# Altium project Origin_pi.PrjPcb
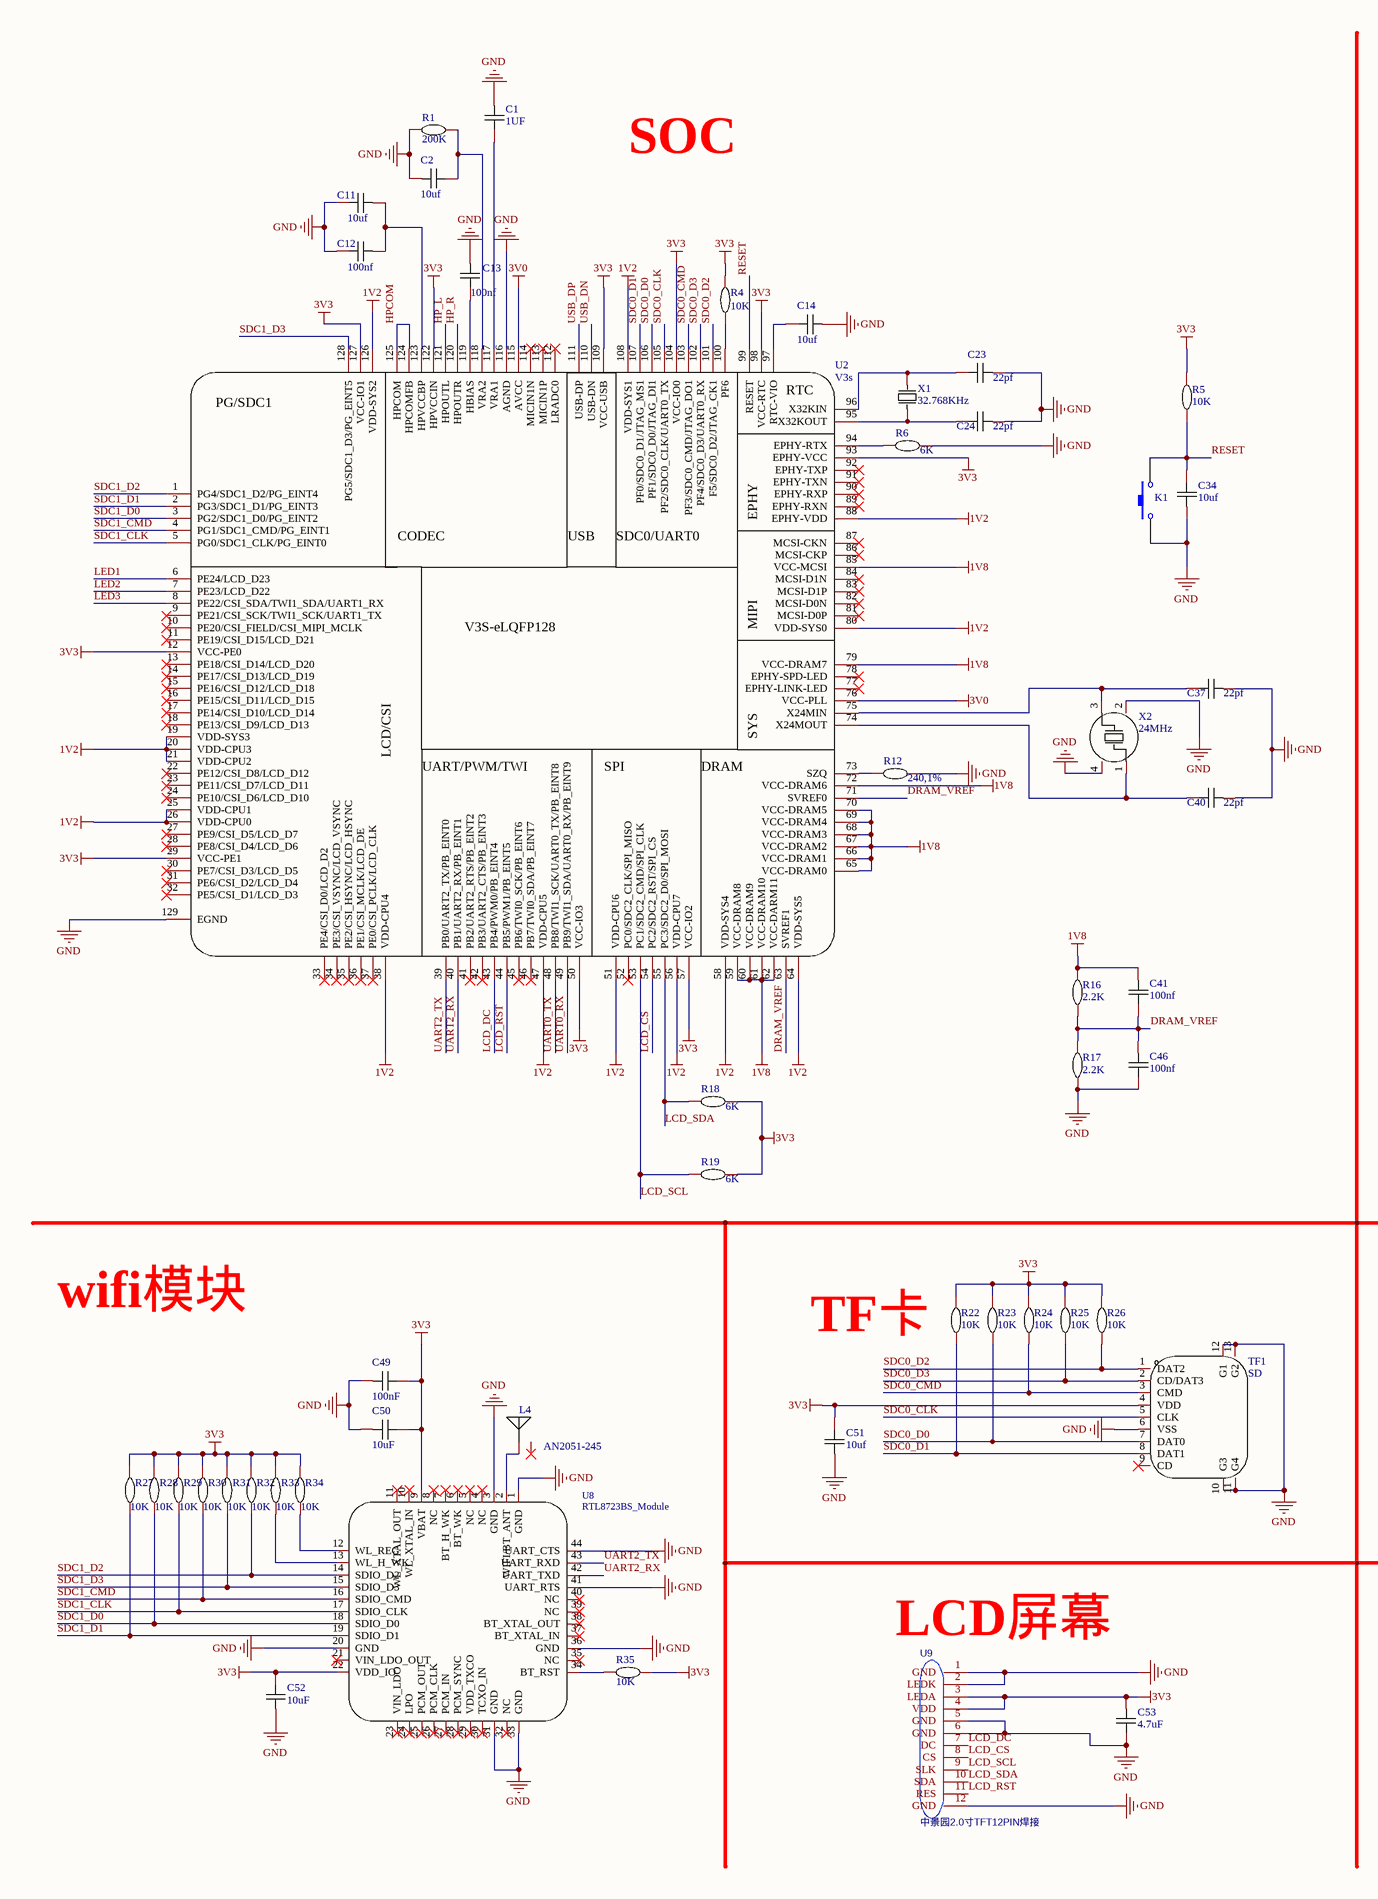
[diagram p0: Origin_pi.SchDoc, left]
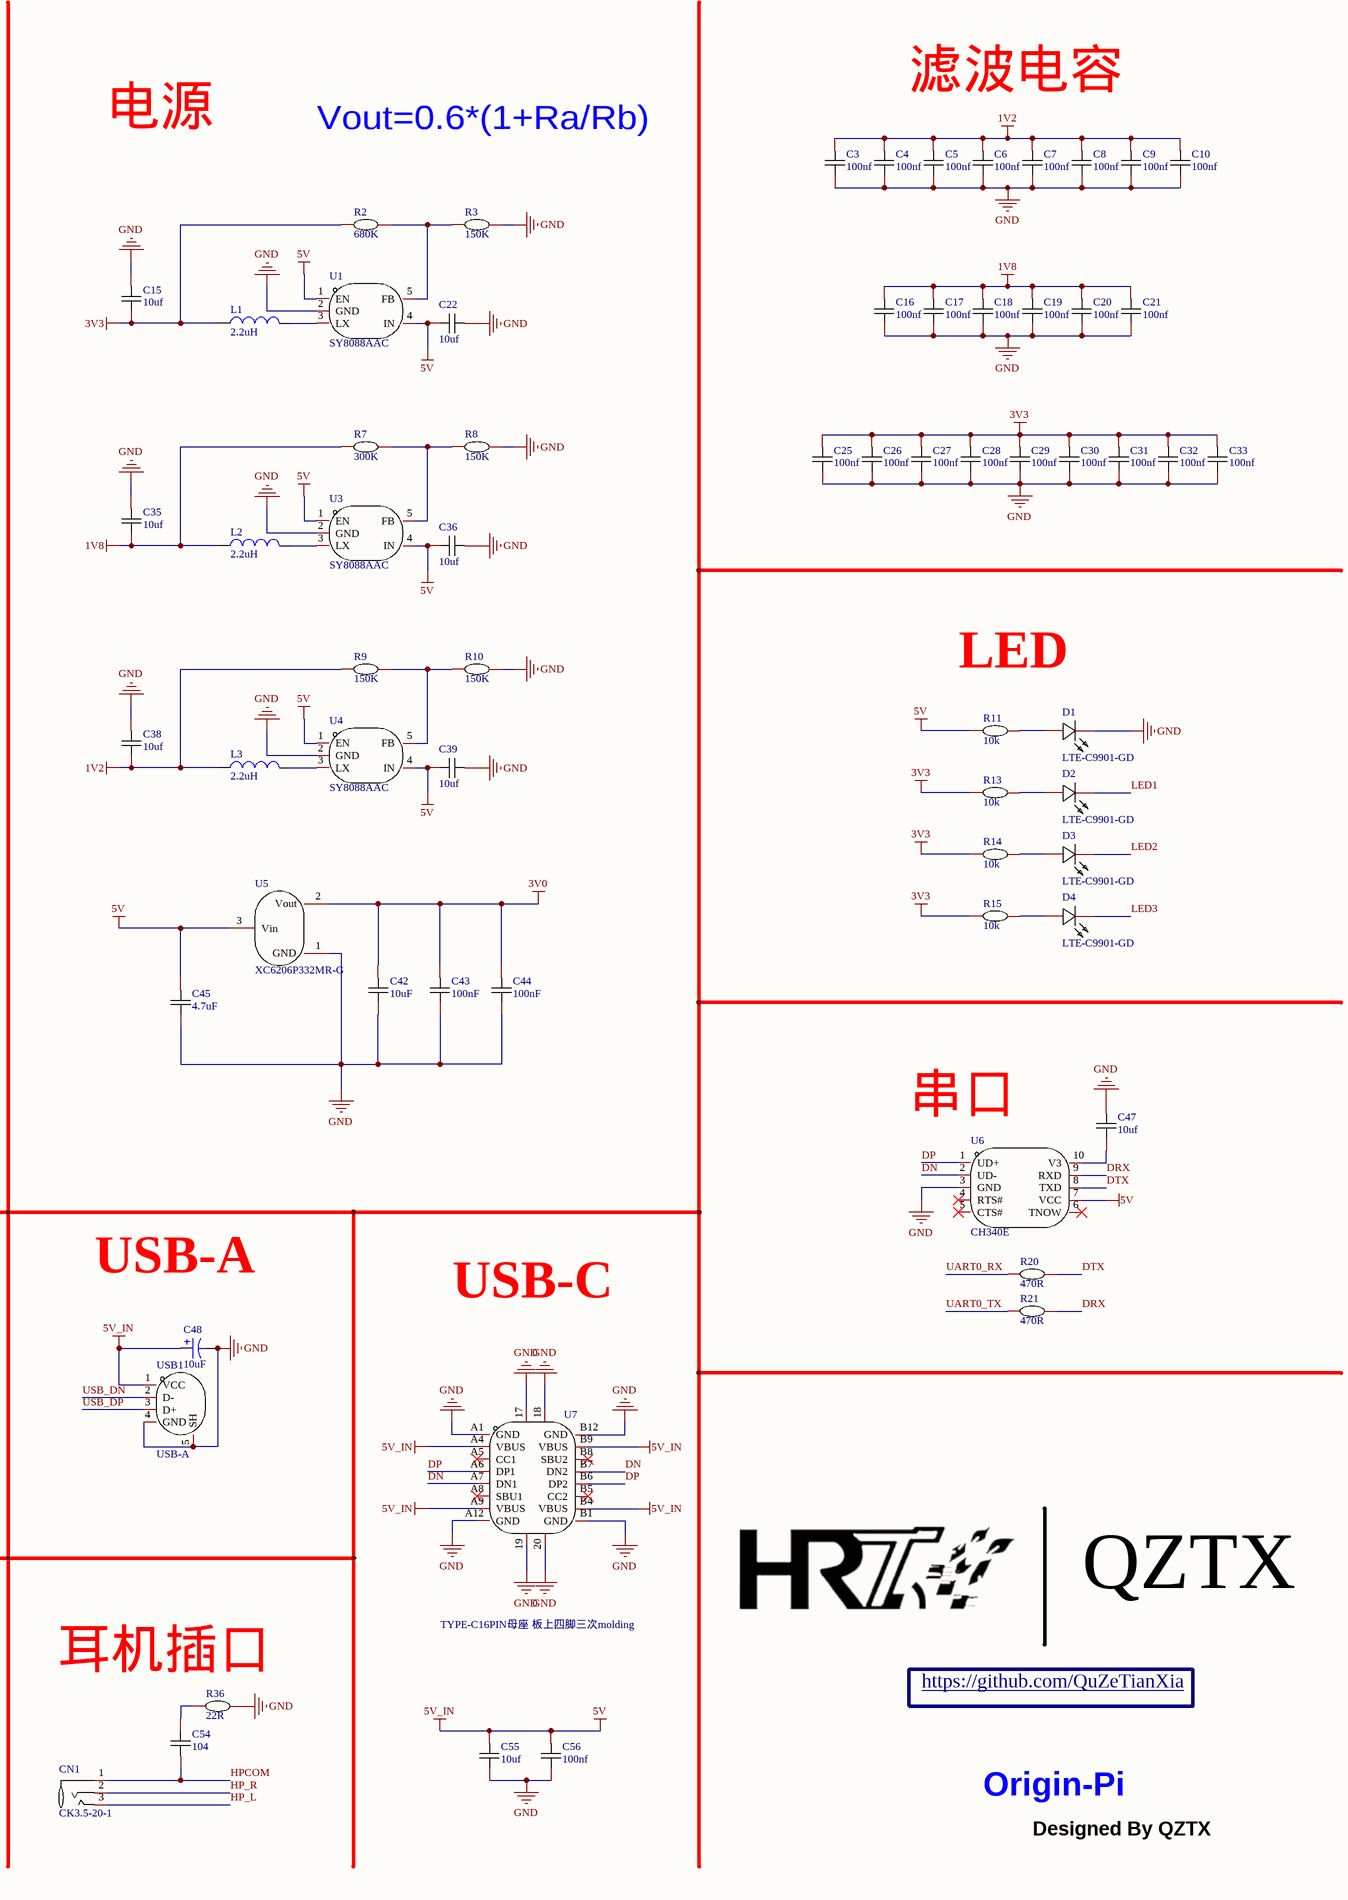
[diagram p1: Origin_pi.SchDoc, right]
1 sheet, 115 parts. Net scope: global (net labels, ports and power ports of the same name join across sheets).
Board file: Origin_pi.PcbDoc

## Sheet Origin_pi.SchDoc
size A2; SheetNumber: 1; SheetTotal: 1

### Parts
C1  Name: 1UF  [PCBComponent_1]  (hidden comment: 0603DS475K160NT)
C2  Name: 10uf  [PCBComponent_1]  (hidden comment: 0603DS475K160NT)
C3  Name: 100nf  [PCBComponent_1]  (hidden comment: 0603DS475K160NT)
C4  Name: 100nf  [PCBComponent_1]  (hidden comment: 0603DS475K160NT)
C5  Name: 100nf  [PCBComponent_1]  (hidden comment: 0603DS475K160NT)
C6  Name: 100nf  [PCBComponent_1]  (hidden comment: 0603DS475K160NT)
C7  Name: 100nf  [PCBComponent_1]  (hidden comment: 0603DS475K160NT)
C8  Name: 100nf  [PCBComponent_1]  (hidden comment: 0603DS475K160NT)
C9  Name: 100nf  [PCBComponent_1]  (hidden comment: 0603DS475K160NT)
C10  Name: 100nf  [PCBComponent_1]  (hidden comment: 0603DS475K160NT)
C11  Name: 10uf  [PCBComponent_1]  (hidden comment: 0603DS475K160NT)
C12  Name: 100nf  [PCBComponent_1]  (hidden comment: 0603DS475K160NT)
C13  Name: 100nf  [PCBComponent_1]  (hidden comment: 0603DS475K160NT)
C14  Name: 10uf  [PCBComponent_1]  (hidden comment: 0603DS475K160NT)
C15  Name: 10uf  [PCBComponent_1]  (hidden comment: 0603DS475K160NT)
C16  Name: 100nf  [PCBComponent_1]  (hidden comment: 0603DS475K160NT)
C17  Name: 100nf  [PCBComponent_1]  (hidden comment: 0603DS475K160NT)
C18  Name: 100nf  [PCBComponent_1]  (hidden comment: 0603DS475K160NT)
C19  Name: 100nf  [PCBComponent_1]  (hidden comment: 0603DS475K160NT)
C20  Name: 100nf  [PCBComponent_1]  (hidden comment: 0603DS475K160NT)
C21  Name: 100nf  [PCBComponent_1]  (hidden comment: 0603DS475K160NT)
C22  Name: 10uf  [PCBComponent_1]  (hidden comment: 0603DS475K160NT)
C23  Name: 22pf  [PCBComponent_1]  (hidden comment: 0603DS475K160NT)
C24  Name: 22pf  [PCBComponent_1]  (hidden comment: 0603DS475K160NT)
C25  Name: 100nf  [PCBComponent_1]  (hidden comment: 0603DS475K160NT)
C26  Name: 100nf  [PCBComponent_1]  (hidden comment: 0603DS475K160NT)
C27  Name: 100nf  [PCBComponent_1]  (hidden comment: 0603DS475K160NT)
C28  Name: 100nf  [PCBComponent_1]  (hidden comment: 0603DS475K160NT)
C29  Name: 100nf  [PCBComponent_1]  (hidden comment: 0603DS475K160NT)
C30  Name: 100nf  [PCBComponent_1]  (hidden comment: 0603DS475K160NT)
C31  Name: 100nf  [PCBComponent_1]  (hidden comment: 0603DS475K160NT)
C32  Name: 100nf  [PCBComponent_1]  (hidden comment: 0603DS475K160NT)
C33  Name: 100nf  [PCBComponent_1]  (hidden comment: 0603DS475K160NT)
C34  Name: 10uf  [PCBComponent_1]  (hidden comment: 0603DS475K160NT)
C35  Name: 10uf  [PCBComponent_1]  (hidden comment: 0603DS475K160NT)
C36  Name: 10uf  [PCBComponent_1]  (hidden comment: 0603DS475K160NT)
C37  Name: 22pf  [PCBComponent_1]  (hidden comment: 0603DS475K160NT)
C38  Name: 10uf  [PCBComponent_1]  (hidden comment: 0603DS475K160NT)
C39  Name: 10uf  [PCBComponent_1]  (hidden comment: 0603DS475K160NT)
C40  Name: 22pf  [PCBComponent_1]  (hidden comment: 0603DS475K160NT)
C41  Name: 100nf  [PCBComponent_1]  (hidden comment: 0603DS475K160NT)
C42  Name: 10uF  [PCBComponent_1]  (hidden comment: 0603DS475K160NT)
C43  Name: 100nF  [PCBComponent_1]  (hidden comment: 0603DS475K160NT)
C44  Name: 100nF  [PCBComponent_1]  (hidden comment: 0603DS475K160NT)
C45  Name: 4.7uF  [PCBComponent_1]  (hidden comment: 0603DS475K160NT)
C46  Name: 100nf  [PCBComponent_1]  (hidden comment: 0603DS475K160NT)
C47  Name: 10uf  [PCBComponent_1]  (hidden comment: 0603DS475K160NT)
C48  10uF  [CP 3528B]
C49  Name: 100nF  [PCBComponent_1]  (hidden comment: 0603DS475K160NT)
C50  Name: 10uF  [PCBComponent_1]  (hidden comment: 0603DS475K160NT)
C51  Name: 10uf  [PCBComponent_1]  (hidden comment: 0603DS475K160NT)
C52  Name: 10uF  [PCBComponent_1]  (hidden comment: 0603DS475K160NT)
C53  Name: 4.7uF  [PCBComponent_1]  (hidden comment: 0603DS475K160NT)
C54  Name: 104  [PCBComponent_1]  (hidden comment: 0603DS475K160NT)
C55  Name: 10uf  [PCBComponent_1]  (hidden comment: 0603DS475K160NT)
C56  Name: 100nf  [PCBComponent_1]  (hidden comment: 0603DS475K160NT)
CN1  CK3.5-20-1  [AUDIO-SMD_CK3.5-20-1]
D1  LTE-C9901-GD  [LED0603-RD]
D2  LTE-C9901-GD  [LED0603-RD]
D3  LTE-C9901-GD  [LED0603-RD]
D4  LTE-C9901-GD  [LED0603-RD]
K1  Key  [KEY 3.6*2.5 SMD]  (value not drawn)
L1  2.2uH  [L 0805]
L2  2.2uH  [L 0805]
L3  2.2uH  [L 0805]
L4  AN2051-245  [ANT2051]
R1  Name: 200K  [PCBComponent_1]  (hidden comment: 贴片电阻_0603_100K_±1%_1/10W)
R2  Name: 680K  [PCBComponent_1]  (hidden comment: 贴片电阻_0603_100K_±1%_1/10W)
R3  Name: 150K  [PCBComponent_1]  (hidden comment: 贴片电阻_0603_100K_±1%_1/10W)
R4  Name: 10K  [PCBComponent_1]  (hidden comment: 贴片电阻_0603_100K_±1%_1/10W)
R5  Name: 10K  [PCBComponent_1]  (hidden comment: 贴片电阻_0603_100K_±1%_1/10W)
R6  Name: 6K  [PCBComponent_1]  (hidden comment: 贴片电阻_0603_100K_±1%_1/10W)
R7  Name: 300K  [PCBComponent_1]  (hidden comment: 贴片电阻_0603_100K_±1%_1/10W)
R8  Name: 150K  [PCBComponent_1]  (hidden comment: 贴片电阻_0603_100K_±1%_1/10W)
R9  Name: 150K  [PCBComponent_1]  (hidden comment: 贴片电阻_0603_100K_±1%_1/10W)
R10  Name: 150K  [PCBComponent_1]  (hidden comment: 贴片电阻_0603_100K_±1%_1/10W)
R11  Name: 10k  [PCBComponent_1]  (hidden comment: 贴片电阻_0603_100K_±1%_1/10W)
R12  Name: 240,1%  [PCBComponent_1]  (hidden comment: 贴片电阻_0603_100K_±1%_1/10W)
R13  Name: 10k  [PCBComponent_1]  (hidden comment: 贴片电阻_0603_100K_±1%_1/10W)
R14  Name: 10k  [PCBComponent_1]  (hidden comment: 贴片电阻_0603_100K_±1%_1/10W)
R15  Name: 10k  [PCBComponent_1]  (hidden comment: 贴片电阻_0603_100K_±1%_1/10W)
R16  Name: 2.2K  [PCBComponent_1]  (hidden comment: 贴片电阻_0603_100K_±1%_1/10W)
R17  Name: 2.2K  [PCBComponent_1]  (hidden comment: 贴片电阻_0603_100K_±1%_1/10W)
R18  Name: 6K  [PCBComponent_1]  (hidden comment: 贴片电阻_0603_100K_±1%_1/10W)
R19  Name: 6K  [PCBComponent_1]  (hidden comment: 贴片电阻_0603_100K_±1%_1/10W)
R20  Name: 470R  [PCBComponent_1]  (hidden comment: 贴片电阻_0603_100K_±1%_1/10W)
R21  Name: 470R  [PCBComponent_1]  (hidden comment: 贴片电阻_0603_100K_±1%_1/10W)
R22  Name: 10K  [PCBComponent_1]  (hidden comment: 贴片电阻_0603_100K_±1%_1/10W)
R23  Name: 10K  [PCBComponent_1]  (hidden comment: 贴片电阻_0603_100K_±1%_1/10W)
R24  Name: 10K  [PCBComponent_1]  (hidden comment: 贴片电阻_0603_100K_±1%_1/10W)
R25  Name: 10K  [PCBComponent_1]  (hidden comment: 贴片电阻_0603_100K_±1%_1/10W)
R26  Name: 10K  [PCBComponent_1]  (hidden comment: 贴片电阻_0603_100K_±1%_1/10W)
R27  Name: 10K  [PCBComponent_1]  (hidden comment: 贴片电阻_0603_100K_±1%_1/10W)
R28  Name: 10K  [PCBComponent_1]  (hidden comment: 贴片电阻_0603_100K_±1%_1/10W)
R29  Name: 10K  [PCBComponent_1]  (hidden comment: 贴片电阻_0603_100K_±1%_1/10W)
R30  Name: 10K  [PCBComponent_1]  (hidden comment: 贴片电阻_0603_100K_±1%_1/10W)
R31  Name: 10K  [PCBComponent_1]  (hidden comment: 贴片电阻_0603_100K_±1%_1/10W)
R32  Name: 10K  [PCBComponent_1]  (hidden comment: 贴片电阻_0603_100K_±1%_1/10W)
R33  Name: 10K  [PCBComponent_1]  (hidden comment: 贴片电阻_0603_100K_±1%_1/10W)
R34  Name: 10K  [PCBComponent_1]  (hidden comment: 贴片电阻_0603_100K_±1%_1/10W)
R35  Name: 10K  [PCBComponent_1]  (hidden comment: 贴片电阻_0603_100K_±1%_1/10W)
R36  Name: 22R  [PCBComponent_1]  (hidden comment: 贴片电阻_0603_100K_±1%_1/10W)
TF1  SD  [TF-SMD_TF-15-15]
U1  SY8088AAC  [SOT-23-5_L3.0-W1.7-P0.95-LS2.8-BR]
U2  V3s  [LQFP-128_L14.0-W14.0-P0.40-LS16.0-BL-EP5.0]
U3  SY8088AAC  [SOT-23-5_L3.0-W1.7-P0.95-LS2.8-BR]
U4  SY8088AAC  [SOT-23-5_L3.0-W1.7-P0.95-LS2.8-BR]
U5  XC6206P332MR-G  [SOT-23-3_L2.9-W1.6-P1.90-LS2.8-BR]
U6  CH340E  [MSOP-10_L3.0-W3.0-P0.50-LS5.0-BL]
U7  TYPE-C16PIN母座 板上四脚三次molding  [USB-SMD_TYPE-C16PIN]
U8  RTL8723BS_Module  [R8723BS]
U9  中景园2.0寸TFT12PIN焊接  [PCBComponent_1 - duplicate]
USB1  USB-A  [USB-A-TH_SIDE-SINK-USB-A]
X1  32.768KHz  [OSC-SMD_L3.2-W1.5]
X2  24MHz  [CRYSTAL-SMD_4P-L3.2-W2.5-BL]

### Nets
1V2: C3.2 C4.2 C5.2 C6.2 C7.2 C8.2 C9.2 C10.2 C38.1 L3.1 R9.2 U2.19(VDD-SYS3) U2.20(VDD-CPU3) U2.21(VDD-CPU2) U2.25(VDD-CPU1) U2.26(VDD-CPU0) U2.38(VDD-CPU4) U2.47(VDD-CPU5) U2.51(VDD-CPU6) U2.56(VDD-CPU7) U2.58(VDD-SYS4) U2.64(VDD-SYS5) U2.80(VDD-SYS0) U2.88(EPHY-VDD) U2.108(VDD-SYS1) U2.126(VDD-SYS2)
1V8: C16.2 C17.2 C18.2 C19.2 C20.2 C21.2 C35.1 C41.2 L2.1 R7.2 R16.1 U2.59(VCC-DRAM8) U2.60(VCC-DRAM9) U2.61(VCC-DRAM10) U2.62(VCC-DARM11) U2.65(VCC-DRAM0) U2.66(VCC-DRAM1) U2.67(VCC-DRAM2) U2.68(VCC-DRAM3) U2.69(VCC-DRAM4) U2.70(VCC-DRAM5) U2.72(VCC-DRAM6) U2.79(VCC-DRAM7) U2.85(VCC-MCSI)
3V0: C42.2 C43.2 C44.2 U2.76(VCC-PLL) U2.115(AVCC) U5.2(Vout)
3V3: C15.1 C25.2 C26.2 C27.2 C28.2 C29.2 C30.2 C31.2 C32.2 C33.2 C49.1 C50.1 C51.1 C52.1 C53.2 L1.1 R2.2 R4.2 R5.2 R13.2 R14.2 R15.2 R18.1 R19.1 R22.1 R23.1 R24.1 R25.1 R26.1 R27.1 R28.1 R29.1 R30.1 R31.1 R32.1 R33.1 R34.1 R35.1 TF1.4(VDD) U2.12(VCC-PE0) U2.29(VCC-PE1) U2.50(VCC-IO3) U2.57(VCC-IO2) U2.93(EPHY-VCC) U2.98(VCC-RTC) U2.104(VCC-IO0) U2.109(VCC-USB) U2.122(HPVCCIN) U2.127(VCC-IO1) U8.9(VBAT) U8.22(VDD_IO) U9.3(LEDA) U9.4(VDD)
5V: C22.1 C36.1 C39.1 C45.2 C48.1 C55.2 C56.2 R11.2 U1.1(EN) U1.4(IN) U3.1(EN) U3.4(IN) U4.1(EN) U4.4(IN) U5.3(Vin) U6.7(VCC) U7.A4(VBUS) U7.A9(VBUS) U7.B4(VBUS) U7.B9(VBUS) USB1.1(VCC)  [also labelled 5V_IN]
GND: C1.2 C2.2 C3.1 C4.1 C5.1 C6.1 C7.1 C8.1 C9.1 C10.1 C11.1 C12.1 C13.2 C14.2 C15.2 C16.1 C17.1 C18.1 C19.1 C20.1 C21.1 C22.2 C23.2 C24.2 C25.1 C26.1 C27.1 C28.1 C29.1 C30.1 C31.1 C32.1 C33.1 C34.2 C35.2 C36.2 C37.2 C38.2 C39.2 C40.2 C42.1 C43.1 C44.1 C45.1 C46.1 C47.2 C48.2 C49.2 C50.2 C51.2 C52.2 C53.1 C55.1 C56.1 D1.1(-) K1.1 R1.2 R3.1 R6.1 R8.1 R10.1 R12.1 R17.2 R36.1 TF1.6(VSS) TF1.10(G3) TF1.11(G4) TF1.12(G1) TF1.13(G2) U1.2(GND) U2.116(AGND) U2.129(EGND) U3.2(GND) U4.2(GND) U5.1(GND) U6.3(GND) U7.17 U7.18 U7.19 U7.20 U7.A1(GND) U7.A12(GND) U7.B1(GND) U7.B12(GND) U8.1(GND) U8.3(GND) U8.20(GND) U8.31(GND) U8.33(GND) U8.36(GND) U8.41(UART_RTS) U8.44(UART_CTS) U9.1(GND) U9.2(LEDK) U9.5(GND) U9.6(GND) U9.12(GND) USB1.4(GND) USB1.5(SH) X2.2(GND) X2.4(GND)
DN: U6.2(UD-) U7.A7(DN1) U7.B7(DN2)
DP: U6.1(UD+) U7.A6(DP1) U7.B6(DP2)
DRAM_VREF: C41.1 C46.2 R16.2 R17.1 U2.63(SVREF1) U2.71(SVREF0)
DRX: R21.1 U6.9(RXD)
DTX: R20.1 U6.8(TXD)
HP_L: CN1.3 U2.121(HPOUTL)
HP_R: CN1.2 U2.120(HPOUTR)
HPCOM: C54.2 CN1.1 U2.124(HPCOMFB) U2.125(HPCOM)
LCD_CS: U2.54(PC2/SDC2_RST/SPI_CS) U9.8(CS)
LCD_DC: U2.43(PB4/PWM0/PB_EINT4) U9.7(DC)
LCD_RST: U2.44(PB5/PWM1/PB_EINT5) U9.11(RES)
LCD_SCL: R19.2 U2.53(PC1/SDC2_CMD/SPI_CLK) U9.9(SLK)
LCD_SDA: R18.2 U2.55(PC3/SDC2_D0/SPI_MOSI) U9.10(SDA)
LED1: D2.1(-) U2.6(PE24/LCD_D23)
LED2: D3.1(-) U2.7(PE23/LCD_D22)
LED3: D4.1(-) U2.8(PE22/CSI_SDA/TWI1_SDA/UART1_RX)
RESET: C34.1 K1.2 R5.1 U2.99(RESET)
SDC0_CLK: TF1.5(CLK) U2.105(PF2/SDC0_CLK/UART0_TX)
SDC0_CMD: R24.2 TF1.3(CMD) U2.103(PF3/SDC0_CMD/JTAG_DO1)
SDC0_D0: R23.2 TF1.7(DAT0) U2.106(PF1/SDC0_D0/JTAG_DI1)
SDC0_D1: R22.2 TF1.8(DAT1) U2.107(PF0/SDC0_D1/JTAG_MS1)
SDC0_D2: R26.2 TF1.1(DAT2) U2.101(F5/SDC0_D2/JTAG_CK1)
SDC0_D3: R25.2 TF1.2(CD/DAT3) U2.102(PF4/SDC0_D3/UART0_RX)
SDC1_CLK: R29.2 U2.5(PG0/SDC1_CLK/PG_EINT0) U8.17(SDIO_CLK)
SDC1_CMD: R30.2 U2.4(PG1/SDC1_CMD/PG_EINT1) U8.16(SDIO_CMD)
SDC1_D0: R28.2 U2.3(PG2/SDC1_D0/PG_EINT2) U8.18(SDIO_D0)
SDC1_D1: R27.2 U2.2(PG3/SDC1_D1/PG_EINT3) U8.19(SDIO_D1)
SDC1_D2: R32.2 U2.1(PG4/SDC1_D2/PG_EINT4) U8.14(SDIO_D2)
SDC1_D3: R31.2 U2.128(PG5/SDC1_D3/PG_EINT5) U8.15(SDIO_D3)
UART0_RX: R20.2 U2.49(PB9/TWI1_SDA/UART0_RX/PB_EINT9)
UART0_TX: R21.2 U2.48(PB8/TWI1_SCK/UART0_TX/PB_EINT8)
UART2_RX: U2.40(PB1/UART2_RX/PB_EINT1) U8.42(UART_TXD)
UART2_TX: U2.39(PB0/UART2_TX/PB_EINT0) U8.43(UART_RXD)
USB_DN: U2.110(USB-DN) USB1.2(D-)
USB_DP: U2.111(USB-DP) USB1.3(D+)
NetC1_1: C1.1 U2.117(VRA1)
NetC2_1: C2.1 R1.1 U2.118(VRA2)
NetC11_2: C11.2 C12.2 U2.123(HPVCCBP)
NetC13_1: C13.1 U2.119(HBIAS)
NetC14_1: C14.1 U2.97(RTC-VIO)
NetC23_1: C23.1 U2.96(X32KIN) X1.2(OSC2)
NetC24_1: C24.1 U2.95(X32KOUT) X1.1(OSC1)
NetC37_1: C37.1 U2.75(X24MIN) X2.3(OSC2)
NetC40_1: C40.1 U2.74(X24MOUT) X2.1(OSC1)
NetC47_1: C47.1 U6.10(V3)
NetC54_1: C54.1 R36.2
NetD1_2: D1.2(+) R11.1
NetD2_2: D2.2(+) R13.1
NetD3_2: D3.2(+) R14.1
NetD4_2: D4.2(+) R15.1
NetL1_2: L1.2 U1.3(LX)
NetL2_2: L2.2 U3.3(LX)
NetL3_2: L3.2 U4.3(LX)
NetL4_1: L4.1(ANT) U8.2(WIFI/BT_ANT)
NetR2_1: R2.1 R3.2 U1.5(FB)
NetR4_1: R4.1 U2.100(PF6)
NetR6_2: R6.2 U2.94(EPHY-RTX)
NetR7_1: R7.1 R8.2 U3.5(FB)
NetR9_1: R9.1 R10.2 U4.5(FB)
NetR12_2: R12.2 U2.73(SZQ)
NetR33_2: R33.2 U8.13(WL_H_WK)
NetR34_2: R34.2 U8.12(WL_REG)
NetR35_2: R35.2 U8.34(BT_RST)

Not connected (* = marked no-connect by the designer): L4 2*; TF1 9(CD)*; U2 9(PE21/CSI_SCK/TWI1_SCK/UART1_TX)* 10(PE20/CSI_FIELD/CSI_MIPI_MCLK)* 11(PE19/CSI_D15/LCD_D21)* 13(PE18/CSI_D14/LCD_D20)* 14(PE17/CSI_D13/LCD_D19)* 15(PE16/CSI_D12/LCD_D18)* 16(PE15/CSI_D11/LCD_D15)* 17(PE14/CSI_D10/LCD_D14)* 18(PE13/CSI_D9/LCD_D13)* 22(PE12/CSI_D8/LCD_D12)* 23(PE11/CSI_D7/LCD_D11)* 24(PE10/CSI_D6/LCD_D10)* 27(PE9/CSI_D5/LCD_D7)* 28(PE8/CSI_D4/LCD_D6)* 30(PE7/CSI_D3/LCD_D5)* 31(PE6/CSI_D2/LCD_D4)* 32(PE5/CSI_D1/LCD_D3)* 33(PE4/CSI_D0/LCD_D2)* 34(PE3/CSI_VSYNC/LCD_VSYNC)* 35(PE2/CSI_HSYNC/LCD_HSYNC)* 36(PE1/CSI_MCLK/LCD_DE)* 37(PE0/CSI_PCLK/LCD_CLK)* 41(PB2/UART2_RTS/PB_EINT2)* 42(PB3/UART2_CTS/PB_EINT3)* 45(PB6/TWI0_SCK/PB_EINT6)* 46(PB7/TWI0_SDA/PB_EINT7)* 52(PC0/SDC2_CLK/SPI_MISO)* 77(EPHY-LINK-LED)* 78(EPHY-SPD-LED)* 81(MCSI-D0P)* 82(MCSI-D0N)* 83(MCSI-D1P)* 84(MCSI-D1N)* 86(MCSI-CKP)* 87(MCSI-CKN)* 89(EPHY-RXN)* 90(EPHY-RXP)* 91(EPHY-TXN)* 92(EPHY-TXP)* 112(LRADC0)* 113(MICIN1P)* 114(MICIN1N)*; U6 4(RTS#)* 5(CTS#)* 6(TNOW)*; U7 A5(CC1)* A8(SBU1)* B5(CC2)* B8(SBU2)*; U8 4(NC)* 5(NC)* 6(BT_WK)* 7(BT_H_WK)* 8(NC)* 10(WL_XTAL_IN)* 11(WL_XTAL_OUT)* 21(VIN_LDO_OUT)* 23(VIN_LDO)* 24(LPO)* 25(PCM_OUT)* 26(PCM_CLK)* 27(PCM_IN)* 28(PCM_SYNC)* 29(VDD_TXCO)* 30(TCXO_IN)* 32(NC)* 35(NC)* 37(BT_XTAL_IN)* 38(BT_XTAL_OUT)* 39(NC)* 40(NC)*

### Notes on the sheet
- SOC
- 电源
- Vout=0.6*(1+Ra/Rb)
- 滤波电容
- LED
- (near U6) 串口
- wifi模块
- USB-A
- USB-C
- TF卡
- QZTX
- (near U9) LCD屏幕
- 耳机插口
- https://github.com/QuZeTianXia
- Origin-Pi
- Designed By QZTX
- (in symbol Allwinner_V3s) RTC; PG/SDC1; EPHY; CODEC; USB; SDC0/UART0; MIPI; V3S-eLQFP128; SYS; LCD/CSI; UART/PWM/TWI; SPI; DRAM

### Library data of the parts
C1-C47 C49-C56 = 贴片电容0603: Manufacturer: FH(风华); Add into BOM: yes; Symbol: 0603DS475K160NT; Device: 0603DS475K160NT; LCSC Part Name: 贴片电容; Supplier Part: C18213190; Manufacturer Part: 0603DS475K160NT; Supplier Footprint: 0603; Datasheet: https://atta.szlcsc.com/upload/public/pdf/source/20220211/3FDF6092789FC56E23A16E03DC7301F9.pdf; Supplier: LCSC; Convert to PCB: yes
C48 = Cap_Pol: 极性电容
CN1 = CK3.5-20-1: Manufacturer: JINJIA(金佳); Add into BOM: yes; Connector Type: 3.5mm耳机座; Current Rating (Max): 500mA; Voltage Rating (Max): 30V; Symbol: CK3.5-20-1; Device: CK3.5-20-1; LCSC Part Name: 3.5mm耳机座; Supplier Part: C718046; Manufacturer Part: CK3.5-20-1; Supplier Footprint: SMD; JLCPCB Part Class: 扩展库; Datasheet: https://atta.szlcsc.com/upload/public/pdf/source/20200805/C718046_04C469F891EDA4D53ADEB63B7833A696.pdf; Supplier: LCSC; Convert to PCB: yes; Operating Temperature Range: -25℃~+70℃; Name: CK3.5-20-1
D1-D4 = LED_0603: Add into BOM: yes; Symbol: LTE-C9901-GD; Device: LTE-C9901-GD; LCSC Part Name: LTE-C9901-GD; Supplier Part: C9900001446; Manufacturer Part: LTE-C9901-GD; Supplier Footprint: LED0603; JLCPCB Part Class: 扩展库; Supplier: LCSC; Convert to PCB: yes; Name: LTE-C9901-GD
K1 = Key: 按键
L1-L3 = Inductor: 电感
L4 = AN2051-245: Manufacturer: rainsun(霖昱微); Add into BOM: yes; Symbol: AN2051-245; Device: AN2051-245; Supplier: LCSC; Manufacturer Part: AN2051-245; Supplier Part: C99727; JLCPCB Part Class: 扩展库; LCSC Part Name: AN2051-245; Supplier Footprint: SMD,2x5.1mm; Datasheet: https://atta.szlcsc.com/upload/public/pdf/source/20170329/1490752053541.pdf; Convert to PCB: yes; Name: AN2051-245
R1-R36 = 贴片电阻_0603: Add into BOM: yes; Symbol: 贴片电阻_0603_100K_±1%_1/10W; Device: 贴片电阻_0603_100K_±1%_1/10W; LCSC Part Name: 贴片电阻_0603_100K_±1%_1/10W; Supplier Part: C9900009623; Manufacturer Part: 贴片电阻_0603_100K_±1%_1/10W; Supplier Footprint: R0603; JLCPCB Part Class: 扩展库; Supplier: LCSC; Convert to PCB: yes
TF1 = SD: Add into BOM: yes; Symbol: SD; Device: SD; LCSC Part Name: SD; Supplier Part: C9900023771; Manufacturer Part: SD; Supplier Footprint: SIM-SMD; JLCPCB Part Class: 扩展库; Supplier: LCSC; Convert to PCB: yes; Name: SD
U1 U3 U4 = SY8088AAC: Manufacturer: silergy(矽力杰); Add into BOM: yes; Function: 降压型; Switch tube (built-in/external): 内置; Symbol: SY8088AAC; Device: SY8088AAC; LCSC Part Name: SY8088AAC; Supplier Part: C79313; Manufacturer Part: SY8088AAC; Supplier Footprint: SOT-23-5; JLCPCB Part Class: 扩展库; Datasheet: https://atta.szlcsc.com/upload/public/pdf/source/20170329/1490752163260.pdf; Supplier: LCSC; Convert to PCB: yes; Input Voltage: -; Output Current (Max): -; Switching Frequency: -; Synchronous Rectification: -; Number of Outputs: -; Topology: -; Name: SY8088AAC
U2 = Allwinner_V3s: Manufacturer: Allwinner(全志); Add into BOM: yes; Symbol: V3S; Device: V3s; Supplier: LCSC; Supplier Part: C2687449; Manufacturer Part: V3s; JLCPCB Part Class: 扩展库; LCSC Part Name: Allwinner V3s; Supplier Footprint: LQFP-128-EP(14x14); Convert to PCB: yes; CPU Core: -; GPIO Ports Number: -; Operating Voltage Range: -; CPU Maximum Speed: -; Program Memory Type: -; Operating Temperature Range: -; ADC (Bit): -; DAC (Bit): -; PWM (Bit): -; 8Bit Timer: -; 16Bit Timer: -; 32Bit Timer: -; CAN: -; UART/USART: -; I2C: -; I2S: -; SPI: -; Universal Serial Bus: -; Internal Comparator: -; Peripheral/Function: -; communication protocol: -; Watchdog: -; Real-Time Clock: -; Infrared Data Association: -; Low-Voltage Detect: -; CCP Capture/Compare: -; LCD Module: -; LED Module: -; Secure Digital Input and Output: -; Direct Memory Access: -; Internal Oscillator: -; Name: V3s
U5 = XC6206P332MR-G_C5446: Manufacturer: TOREX(特瑞仕); Add into BOM: yes; Output Type: 固定; Maximum Input Voltage: 6V; Output Voltage: 3.3V; MAX Output Current: 200mA; Dropout Voltage: 680mV@(100mA); Output Polarity: 正极; Number of Outputs: 1; Symbol: XC6206P332MR; Device: XC6206P332MR-G_C5446; LCSC Part Name: 输入6V 输出3.3V 200mA; Supplier Part: C5446; Manufacturer Part: XC6206P332MR-G; Supplier Footprint: SOT-23-3L; JLCPCB Part Class: 基础库; Datasheet: https://atta.szlcsc.com/upload/public/pdf/source/20130823/1457706639850.pdf; Supplier: LCSC; Convert to PCB: yes; Power Supply Rejection Ratio (PSRR): -; Name: XC6206P332MR-G
U6 = CH340E: Manufacturer: WCH(南京沁恒); Add into BOM: yes; Applications Function: 收发器; Protocol: USB 2.0; Supply Voltage: 3.3V；5V; Data Rate: 2Mbps; Symbol: CH340E; Device: CH340E; LCSC Part Name: USB转串口芯片 CH340; Supplier Part: C99652; Manufacturer Part: CH340E; Supplier Footprint: MSOP-10; JLCPCB Part Class: 扩展库; Datasheet: https://atta.szlcsc.com/upload/public/pdf/source/20230530/6E401E9554E9F5311886CC8B3F89B62E.pdf; Supplier: LCSC; Convert to PCB: yes; Name: CH340E
U7 = TYPE-C16PIN母座 板上四脚三次molding: Add into BOM: yes; Symbol: TYPE-C16PIN母座 板上四脚三次MOLDING; Device: TYPE-C16PIN母座 板上四脚三次molding; LCSC Part Name: TYPE-C16PIN母座 板上四脚三次molding; Supplier Part: C9900000202; Manufacturer Part: TYPE-C16PIN母座 板上四脚三次molding; Supplier Footprint: TYPE-C16PIN; JLCPCB Part Class: 扩展库; Datasheet: 2021-09-15/03900G/aaf837f0873f462e9eab7ac60a9bb940/aac77-74p5r.pdf; Supplier: LCSC; Convert to PCB: yes; Name: TYPE-C16PIN母座 板上四脚三次molding
U8 = RTL8723BS: Add into BOM: yes; Symbol: RTL8723BS_Module; Device: R8723BS; Convert to PCB: yes; Origin Footprint: R8723BS; Name: RTL8723BS_Module
U9 = 中景园2.0寸TFT12PIN焊接: Contributor: liam_sugar; spicePre: U; spiceSymbolName: 中景园2.0寸TFT12PIN焊接
USB1 = USB-A: Add into BOM: yes; Symbol: USB-A; Device: USB-A; LCSC Part Name: USB-A; Supplier Part: C9900005029; Manufacturer Part: USB-A; Supplier Footprint: USB-A沉板母座; Supplier: LCSC; Convert to PCB: yes; Name: USB-A
X1 = 32.768KHz_C9900004736: Add into BOM: yes; Symbol: 32.768KHZ; Device: 32.768KHz_C9900004736; LCSC Part Name: 32.768KHz; Supplier Part: C9900004736; Manufacturer Part: 32.768KHz; Supplier Footprint: OSC-SMD_L3.2-W1.5; JLCPCB Part Class: 扩展库; Supplier: LCSC; Convert to PCB: yes; Name: 32.768KHz
X2 = X322524MSB4SI: Manufacturer: YXC(扬兴晶振); Add into BOM: yes; Crystal Type: 贴片晶振; Normal temperature Frequency Tolerance: ±10ppm; External load capacitor: 20pF; Frequency Stability(Full temperature range): ±30ppm; Symbol: X322524MSB4SI; Device: X322524MSB4SI; LCSC Part Name: 24MHz ±10ppm 20pF; Supplier Part: C15643; Manufacturer Part: X322524MSB4SI; Supplier Footprint: SMD3225-4P; JLCPCB Part Class: 扩展库; Datasheet: https://atta.szlcsc.com/upload/public/pdf/source/20210329/C112971_1F611BDC486E193C1706F6D8EB5AA189.pdf; Supplier: LCSC; Convert to PCB: yes; Value: 24MHz; Operating Temperature: -40℃~+85℃; Name: 24MHz